# EAGLE schematic RTK_Mosaic_X5 (EAGLE 9.6.2)

## Sheet 1 of 2
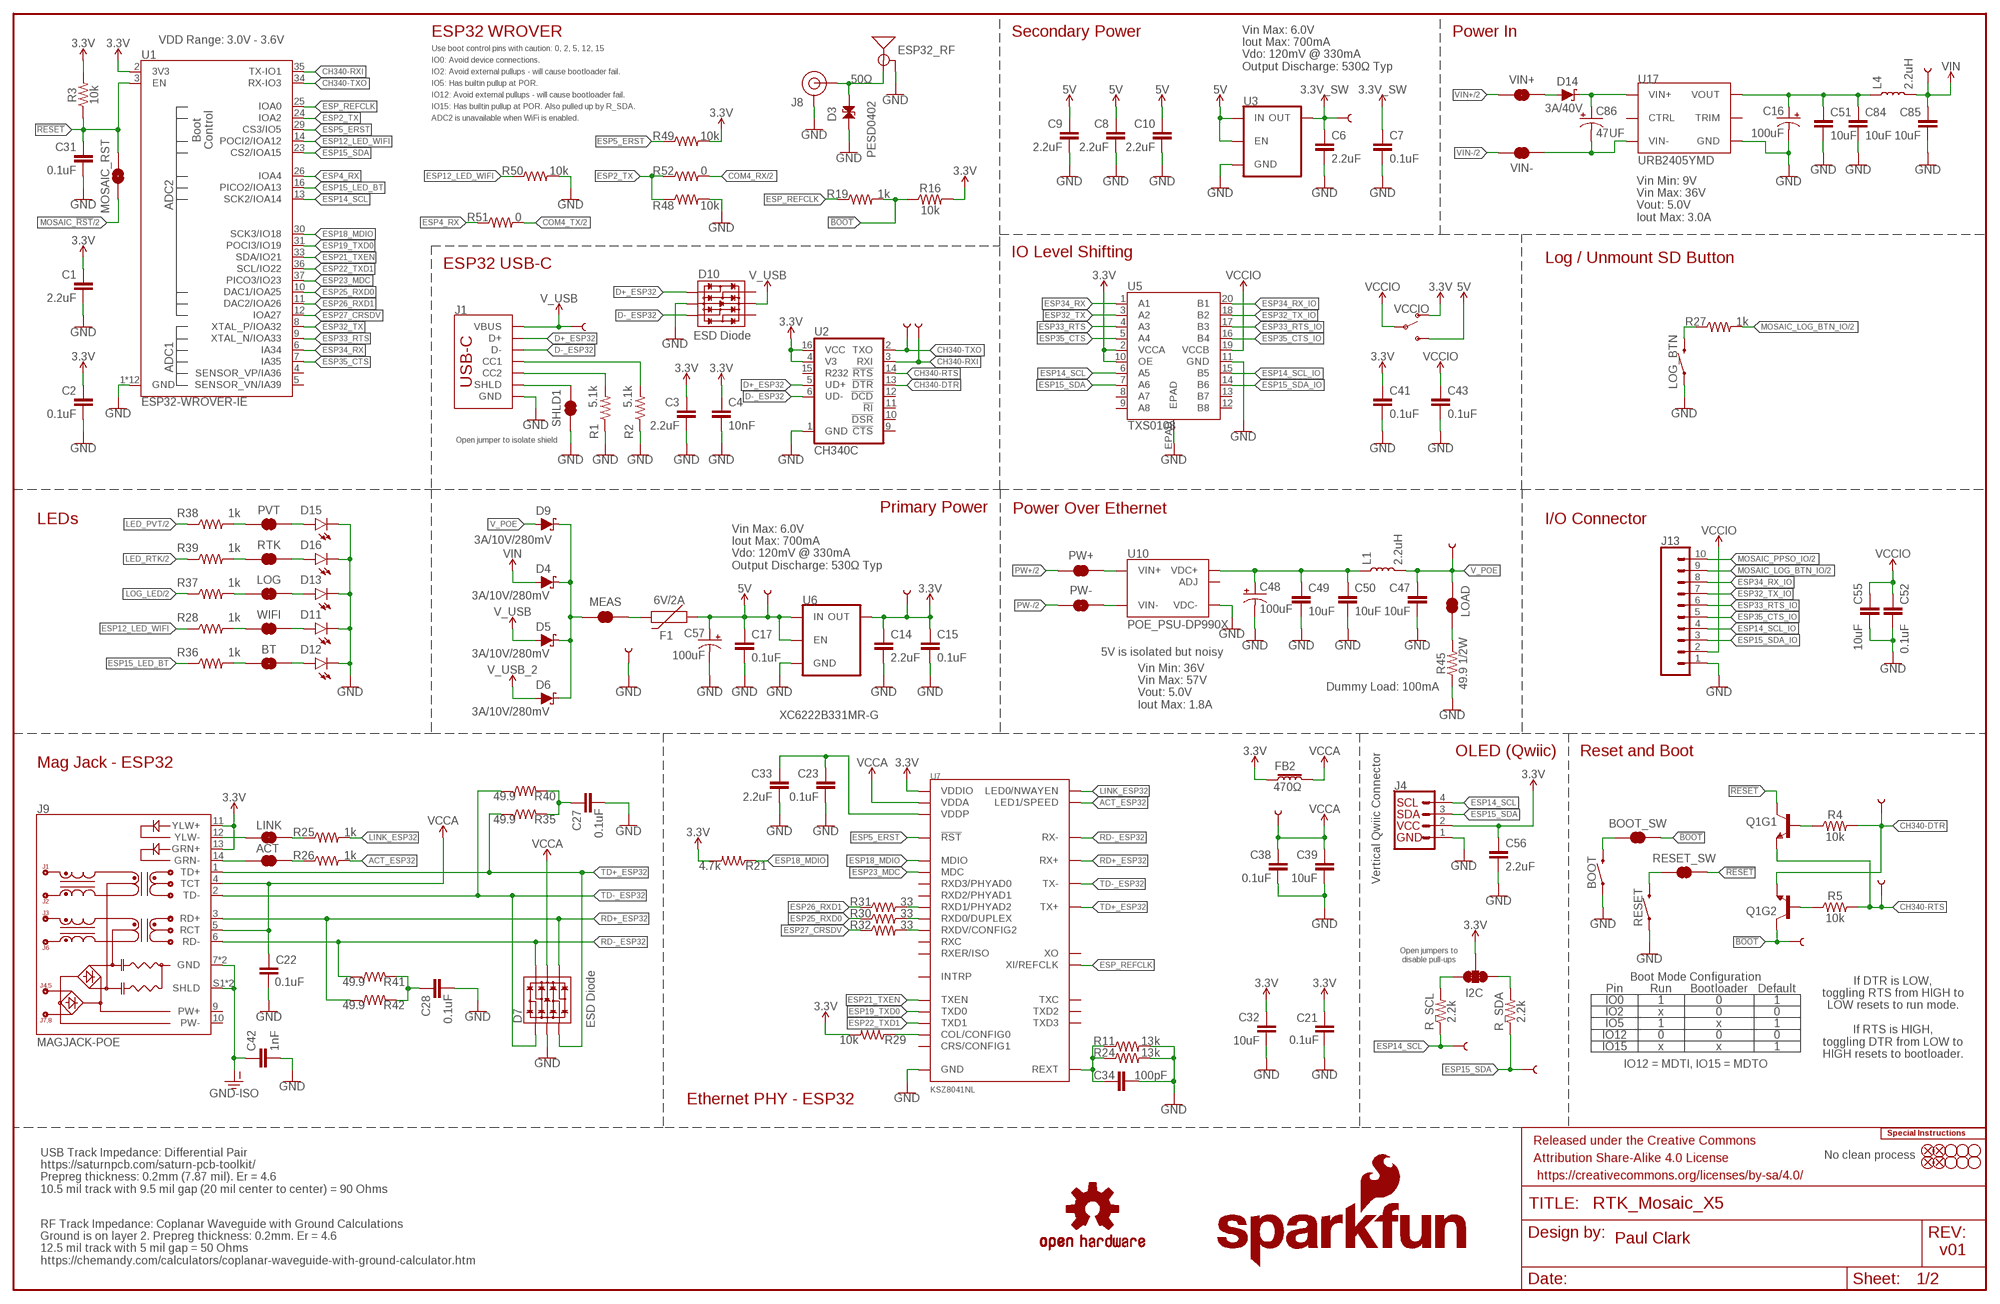
[diagram p0: schematic, sheet 1]

### Parts
3V3  TEST-POINTPOGO_PTH  [1X01_NO_SILK]
3V3_SW  TEST-POINTPOGO_PTH  [1X01_NO_SILK]
5V  TEST-POINTPOGO_PTH  [1X01_NO_SILK]
ACT  JUMPER-SMT_2_NC_TRACE_SILK  [SMT-JUMPER_2_NC_TRACE_SILK]
BOOT  MOMENTARY-SWITCH-SPST-PTH-RIGHT-ANGLE-8-020  [TACTILE_SWITCH_PTH_RA_8-020]
BOOT_SW  JUMPER-SMT_2_NC_TRACE_SILK  [SMT-JUMPER_2_NC_TRACE_SILK]
BT  JUMPER-SMT_2_NC_TRACE_SILK  [SMT-JUMPER_2_NC_TRACE_SILK]
C1  2.2uF  2.2UF-0603-10V-20%  [0603]
C2  0.1uF  0.1UF-0603-25V-5%  [0603]
C3  2.2uF  2.2UF-0603-10V-20%  [0603]
C4  10nF  10NF-0603-50V-10%  [0603]
C6  2.2uF  2.2UF-0603-10V-20%  [0603]
C7  0.1uF  0.1UF-0603-25V-5%  [0603]
C8  2.2uF  2.2UF-0603-10V-20%  [0603]
C9  2.2uF  2.2UF-0603-10V-20%  [0603]
C10  2.2uF  2.2UF-0603-10V-20%  [0603]
C14  2.2uF  2.2UF-0603-10V-20%  [0603]
C15  0.1uF  0.1UF-0603-25V-5%  [0603]
C16  100uF  100UF-POLAR-25V-20%(ELEC)  [PANASONIC_D]
C17  0.1uF  0.1UF-0603-25V-5%  [0603]
C21  0.1uF  0.1UF-0603-25V-5%  [0603]
C22  0.1uF  0.1UF-0603-25V-5%  [0603]
C23  0.1uF  0.1UF-0603-25V-5%  [0603]
C27  0.1uF  0.1UF-0603-25V-5%  [0603]
C28  0.1uF  0.1UF-0603-25V-5%  [0603]
C31  0.1uF  0.1UF-0603-25V-5%  [0603]
C32  10uF  10UF-0603-6.3V-20%  [0603]
C33  2.2uF  2.2UF-0603-10V-20%  [0603]
C34  100pF  100PF-0603-50V-5%  [0603]
C38  0.1uF  0.1UF-0603-25V-5%  [0603]
C39  10uF  10UF-0603-6.3V-20%  [0603]
C41  0.1uF  0.1UF-0603-25V-5%  [0603]
C42  1nF  1.0NF/1000PF-1206-2KV-10%  [1206]
C43  0.1uF  0.1UF-0603-25V-5%  [0603]
C47  10uF  10UF-0805-25V-10%  [0805]
C48  100uF  100UF-POLAR-25V-20%(ELEC)  [PANASONIC_D]
C49  10uF  10UF-0805-25V-10%  [0805]
C50  10uF  10UF-0805-25V-10%  [0805]
C51  10uF  10UF-0805-25V-10%  [0805]
C52  0.1uF  0.1UF-0603-25V-5%  [0603]
C55  10uF  10UF-0603-6.3V-20%  [0603]
C56  2.2uF  2.2UF-0603-10V-20%  [0603]
C57  100uF  100UF-POLAR-25V-20%(ELEC)  [PANASONIC_D]
C84  10uF  10UF-0805-25V-10%  [0805]
C85  10uF  10UF-0805-25V-10%  [0805]
C86  47UF  47UF-POLAR-PANASONIC_D-50V-20%  [PANASONIC_D]
D3  PESD0402  PESD0402-0402  [0402]
D4  3A/10V/280mV  DIODE-SCHOTTKY-BAT60A  [SOD-323]
D5  3A/10V/280mV  DIODE-SCHOTTKY-BAT60A  [SOD-323]
D6  3A/10V/280mV  DIODE-SCHOTTKY-BAT60A  [SOD-323]
D7  ESD Diode  TVS_DIODE_ARRAY_DT1042-04SO-7  [SOT-23-6]
D9  3A/10V/280mV  DIODE-SCHOTTKY-BAT60A  [SOD-323]
D10  ESD Diode  TVS_DIODE_ARRAY_DT1042-04SO-7  [SOT-23-6]
D11  LED-RIGHT-ANGLE-PTH-AMBER  [CBI-RIGHT-ANGLE-PTH]
D12  LED-RIGHT-ANGLE-PTH-BLUE  [CBI-RIGHT-ANGLE-PTH]
D13  LED-RIGHT-ANGLE-PTH-GREEN  [CBI-RIGHT-ANGLE-PTH]
D14  3A/40V  DIODE-SCHOTTKY-B340A  [SMA-DIODE]
D15  LED-RIGHT-ANGLE-PTH-BLUE  [CBI-RIGHT-ANGLE-PTH]
D16  LED-RIGHT-ANGLE-PTH-BLUE  [CBI-RIGHT-ANGLE-PTH]
DTR  TEST-POINTPOGO_PTH  [1X01_NO_SILK]
ESP32_RF  ANTENNA-SMA-GROUNDEDEDGE_RPSMA  [RP-SMA-EDGE]
F1  6V/2A  PPTC_6V2A  [1210]
FB2  470Ω  FERRITE_BEAD-0603-470Ω-100MHZ-1A-200MILIΩ  [0603]
FD1  FIDUCIAL1X2  [FIDUCIAL-1X2]
FD2  FIDUCIAL1X2  [FIDUCIAL-1X2]
FD3  FIDUCIAL1X2  [FIDUCIAL-1X2]
FD4  FIDUCIAL1X2  [FIDUCIAL-1X2]
FRAME1  FRAME-LEDGER  [CREATIVE_COMMONS]
GND  TEST-POINTPOGO_PTH  [1X01_NO_SILK]
H1  STAND-OFFTIGHT  [STAND-OFF-TIGHT]
H2  STAND-OFFTIGHT  [STAND-OFF-TIGHT]
H3  STAND-OFFTIGHT  [STAND-OFF-TIGHT]
H4  STAND-OFFTIGHT  [STAND-OFF-TIGHT]
H5  STAND-OFFTIGHT  [STAND-OFF-TIGHT]
H6  STAND-OFFTIGHT  [STAND-OFF-TIGHT]
I2C  JUMPER-SMT_3_2-NC_TRACE_SILK  [SMT-JUMPER_3_2-NC_TRACE_SILK]
J1  USB_C_4-LAYER_PADS  [USB-C-16P_4LAYER-PADS]
J4  Vertical Qwiic Connector  QWIIC_CONNECTOR  [JST04_1MM_VERT]
J8  U.FL2PIN-REDUCED-FOOTPRINT  [U.FL_REDUCED_FOOTPRINT]
J9  MAGJACK-POE  [MAGJACK-SYM_LED]
J13  CONN_10_3.5MM_RA_HEADER  [1X10_SCREW_TERMINAL_3.5MM]
L1  2.2uH  INDUCTOR-0805_WIDE-2.2UH  [0805-WIDE]
L4  2.2uH  INDUCTOR-0805_WIDE-2.2UH  [0805-WIDE]
LINK  JUMPER-SMT_2_NC_TRACE_SILK  [SMT-JUMPER_2_NC_TRACE_SILK]
LOAD  JUMPER-SMT_2_NC_TRACE_SILK  [SMT-JUMPER_2_NC_TRACE_SILK]
LOG  JUMPER-SMT_2_NC_TRACE_SILK  [SMT-JUMPER_2_NC_TRACE_SILK]
LOG_BTN  MOMENTARY-SWITCH-SPST-PTH-RIGHT-ANGLE-8-020  [TACTILE_SWITCH_PTH_RA_8-020]
LOGO1  SPECIAL_INSTRUCTIONS-ORDERING  [ORDERING_INSTRUCTIONS]
LOGO4  OSHW-LOGOS  [OSHW-LOGO-S]
LOGO5  SFE_LOGO_NAME.2_INCH  [SFE_LOGO_NAME_.2]
LOGO6  SFE_LOGO_FLAME.2_INCH  [SFE_LOGO_FLAME_.2]
MEAS  JUMPER-COMBO_2_NC_TRACE  [COMBO-JUMPER_2_NC_TRACE]
MOSAIC_RST  JUMPER-COMBO_2_NO  [COMBO-JUMPER_2_NO]
PVT  JUMPER-SMT_2_NC_TRACE_SILK  [SMT-JUMPER_2_NC_TRACE_SILK]
PW+  JUMPER-COMBO_2_NC_TRACE  [COMBO-JUMPER_2_NC_TRACE]
PW-  JUMPER-COMBO_2_NC_TRACE  [COMBO-JUMPER_2_NC_TRACE]
Q1  TRANS_NPN_DUAL-MBT3904DW1T1  [SC70-6]
R1  5.1k  5.1KOHM5.1KOHM-0603-1/10W-1%  [0603]
R2  5.1k  5.1KOHM5.1KOHM-0603-1/10W-1%  [0603]
R3  10k  10KOHM-0603-1/10W-1%  [0603]
R4  10k  10KOHM-0603-1/10W-1%  [0603]
R5  10k  10KOHM-0603-1/10W-1%  [0603]
R11  13k  13KOHM-0603-1/10W-1%  [0603]
R16  10k  10KOHM-0603-1/10W-1%  [0603]
R19  1k  1KOHM-0603-1/10W-1%  [0603]
R21  4.7k  4.7KOHM-0603-1/10W-1%  [0603]
R24  13k  13KOHM-0603-1/10W-1%  [0603]
R25  1k  1KOHM-0603-1/10W-1%  [0603]
R26  1k  1KOHM-0603-1/10W-1%  [0603]
R27  1k  1KOHM-0603-1/10W-1%  [0603]
R28  1k  1KOHM-0603-1/10W-1%  [0603]
R29  10k  10KOHM-0603-1/10W-1%  [0603]
R30  33  33OHM-0603-1/10W-1%  [0603]
R31  33  33OHM-0603-1/10W-1%  [0603]
R32  33  33OHM-0603-1/10W-1%  [0603]
R35  49.9  49.9OHM-0603-1/10W-1%  [0603]
R36  1k  1KOHM-0603-1/10W-1%  [0603]
R37  1k  1KOHM-0603-1/10W-1%  [0603]
R38  1k  1KOHM-0603-1/10W-1%  [0603]
R39  1k  1KOHM-0603-1/10W-1%  [0603]
R40  49.9  49.9OHM-0603-1/10W-1%  [0603]
R41  49.9  49.9OHM-0603-1/10W-1%  [0603]
R42  49.9  49.9OHM-0603-1/10W-1%  [0603]
R45  49.9 1/2W  49.9OHM-1206-1/2W-1%  [1206]
R48  10k  10KOHM-0603-1/10W-1%  [0603]
R49  10k  10KOHM-0603-1/10W-1%  [0603]
R50  10k  10KOHM-0603-1/10W-1%  [0603]
R51  0  0OHM-0603-1/10W  [0603]
R52  0  0OHM-0603-1/10W  [0603]
R_SCL  2.2k  2.2KOHM-0603-1/10W-1%  [0603]
R_SDA  2.2k  2.2KOHM-0603-1/10W-1%  [0603]
RESET  MOMENTARY-SWITCH-SPST-PTH-RIGHT-ANGLE-8-020  [TACTILE_SWITCH_PTH_RA_8-020]
RESET_SW  JUMPER-SMT_2_NC_TRACE_SILK  [SMT-JUMPER_2_NC_TRACE_SILK]
RTK  JUMPER-SMT_2_NC_TRACE_SILK  [SMT-JUMPER_2_NC_TRACE_SILK]
RTS  TEST-POINTPOGO_PTH  [1X01_NO_SILK]
RX  TEST-POINTPOGO_PTH  [1X01_NO_SILK]
SCL2  TEST-POINTPOGO_PTH  [1X01_NO_SILK]
SDA2  TEST-POINTPOGO_PTH  [1X01_NO_SILK]
SHLD1  JUMPER-SMT_2_NC_TRACE_SILK  [SMT-JUMPER_2_NC_TRACE_SILK]
TP_BOOT  TEST-POINTPOGO_PTH  [1X01_NO_SILK]
TX  TEST-POINTPOGO_PTH  [1X01_NO_SILK]
U1  ESP32-WROVER-IE  ESP32-WROVER-E/IE_IE-N16R8  [ESP32-WROVER-E/IE]
U2  CH340C  [SO016]
U3  XC6222B331MR-G  [SOT23-5]
U5  TXS0108  TXS0108-VFQFN_20  [VFQFN-20]
U6  XC6222B331MR-G  [SOT23-5]
U7  KSZ8041NL  [MLF55Q-32LD]
U10  POE_PSU-DP990X  [DP990X]
U17  URB2405YMD  URB_YMD-15WR3__URB2405YMD-15WR3  [URB_YMD-15WR3]
VCCA  TEST-POINTPOGO_PTH  [1X01_NO_SILK]
VCCIO  SWITCH-SPDT-SMD-AYZ0202  [SWITCH_DPDT_SMD_AYZ0202]
VIN  TEST-POINTPOGO_PTH  [1X01_NO_SILK]
VIN+  JUMPER-COMBO_2_NC_TRACE  [COMBO-JUMPER_2_NC_TRACE]
VIN-  JUMPER-COMBO_2_NC_TRACE  [COMBO-JUMPER_2_NC_TRACE]
VPOE  TEST-POINTPOGO_PTH  [1X01_NO_SILK]
VUSB  TEST-POINTPOGO_PTH  [1X01_NO_SILK]
WIFI  JUMPER-SMT_2_NC_TRACE_SILK  [SMT-JUMPER_2_NC_TRACE_SILK]

### Nets
3.3V: 3V3.1 C1.1 C2.1 C3.1 C4.1 C14.1 C15.1 C21.1 C32.1 C41.1 C56.1 FB2.1 I2C.2 J4.2 J9.11(YLW+) J9.13(GRN+) R3.2 R16.2 R21.2 R29.2 R49.2 U1.2(3V3) U2.4(V3) U2.16(VCC) U5.2(VCCA) U5.10(OE) U6.5(OUT) U7.17(VDDIO) VCCIO.1(O)
3.3V_SW: 3V3_SW.1 C6.1 C7.1 U3.5(OUT) ; also sheet 2
5V: 5V.1 C8.1 C9.1 C10.1 C17.1 C57.+ F1.1 U3.1(IN) U3.3(EN) U6.1(IN) U6.3(EN) VCCIO.3(S) ; also sheet 2
5V_RAW: C48.+ C49.1 C50.1 L1.1 U10.1(VDC+) U10.2(VDC+)
5V_RAW1: C16.+ C51.1 C84.1 L4.1 U17.4(VOUT)
!BOOT!: BOOT_SW.1 Q1.6(C) R16.1 R19.2 TP_BOOT.1
!RESET!: C31.1 MOSAIC_RST.2 MOSAIC_RST.4 Q1.3(C) R3.1 RESET_SW.1 U1.3(EN)
ACT: ACT.1 J9.14(GRN-)
ACT_ESP32: R26.2 U7.31(LED1/SPEED)
CH340-DTR: DTR.1 Q1.1(E) R4.2 U2.13(!DTR)
CH340-RTS: Q1.4(E) R5.2 RTS.1 U2.14(!RTS)
CH340-RXI: TX.1 U1.35(TX-IO1) U2.3(RXI)
CH340-TXO: RX.1 U1.34(RX-IO3) U2.2(TXO)
COM4_RX: R52.2 ; also sheet 2
COM4_TX: R51.2 ; also sheet 2
D+_ESP32: D10.1(IO1) J1.A6(D+) J1.B6(D+) U2.5(UD+)
D-_ESP32: D10.3(IO2) J1.A7(D-) J1.B7(D-) U2.6(UD-)
ESP2_TX: R48.1 R52.1 U1.24(IOA2)
ESP4_RX: R51.1 U1.26(IOA4)
ESP5_ERST: R49.1 U1.29(CS3/IO5) U7.32(!RST!)
ESP12_LED_WIFI: R28.1 R50.1 U1.14(POCI2/IOA12)
ESP14_SCL: J4.4 R_SCL.1 SCL2.1 U1.13(SCK2/IOA14) U5.6(A5)
ESP14_SCL_IO: J13.4 U5.15(B5)
ESP15_LED_BT: R36.1 U1.16(PICO2/IOA13)
ESP15_SDA: J4.3 R_SDA.1 SDA2.1 U1.23(CS2/IOA15) U5.7(A6)
ESP15_SDA_IO: J13.3 U5.14(B6)
ESP18_MDIO: R21.1 U1.30(SCK3/IO18) U7.11(MDIO)
ESP19_TXD0: U1.31(POCI3/IO19) U7.24(TXD0)
ESP21_TXEN: U1.33(SDA/IO21) U7.23(TXEN)
ESP22_TXD1: U1.36(SCL/IO22) U7.25(TXD1)
ESP23_MDC: U1.37(PICO3/IO23) U7.12(MDC)
ESP25_RXD0: R30.1 U1.10(DAC1/IOA25)
ESP26_RXD1: R31.1 U1.11(DAC2/IOA26)
ESP27_CRSDV: R32.1 U1.12(IOA27)
ESP32_TX: U1.8(XTAL_P/IOA32) U5.3(A2)
ESP32_TX_IO: J13.7 U5.18(B2)
ESP33_RTS: U1.9(XTAL_N/IOA33) U5.4(A3)
ESP33_RTS_IO: J13.6 U5.17(B3)
ESP34_RX: U1.6(IA34) U5.1(A1)
ESP34_RX_IO: J13.8 U5.20(B1)
ESP35_CTS: U1.7(IA35) U5.5(A4)
ESP35_CTS_IO: J13.5 U5.16(B4)
ESP_REFCLK: R19.1 U1.25(IOA0) U7.9(XI/REFCLK)
GND: BOOT.1 C1.2 C2.2 C3.2 C4.2 C6.2 C7.2 C8.2 C9.2 C10.2 C14.2 C15.2 C16.- C17.2 C21.2 C22.2 C23.2 C27.2 C28.2 C31.2 C32.2 C33.2 C34.2 C38.2 C39.2 C41.2 C42.2 C43.2 C47.2 C48.- C49.2 C50.2 C51.2 C52.2 C55.2 C56.2 C57.- C84.2 C85.2 D3.2 D7.2(VSS) D10.2(VSS) D11.C D12.C D13.C D15.C D16.C ESP32_RF.GND@0(GND) ESP32_RF.GND@1(GND) ESP32_RF.GND@2(GND) ESP32_RF.GND@3(GND) GND.1 J1.GND J1.GND2(GND) J4.1 J8.1(GND) J8.2(GND) J13.1 LOG_BTN.1 R1.1 R2.1 R11.2 R24.2 R45.1 R48.2 R50.2 RESET.1 SHLD1.1 U1.1(GND) U1.15(GND) U1.38(GND) U1.GND U1.GNDT1(GND) U1.GNDT2(GND) U1.GNDT3(GND) U1.GNDT4(GND) U1.GNDT5(GND) U1.GNDT6(GND) U1.GNDT7(GND) U1.GNDT8(GND) U2.1(GND) U3.2(GND) U5.11(GND) U5.EPAD U6.2(GND) U7.1(GND) U7.GND U10.3(VDC-) U17.6(GND) ; also sheet 2
GND-ISO: C42.1 J9.7(GND) J9.8(GND) J9.S1(SHLD) J9.S2(SHLD) ; also sheet 2
LED_PVT: R38.1 ; also sheet 2
LED_RTK: R39.1 ; also sheet 2
LINK: J9.12(YLW-) LINK.1
LINK_ESP32: R25.2 U7.30(LED0/NWAYEN)
LOG_LED: R37.1 ; also sheet 2
MEAS: D4.C D5.C D6.C D9.C MEAS.2 MEAS.4
MOSAIC_!RST!: MOSAIC_RST.1 MOSAIC_RST.3 ; also sheet 2
MOSAIC_LOG_BTN_IO: J13.9 R27.2 ; also sheet 2
MOSAIC_PPSO_IO: J13.10 ; also sheet 2
N$1: J1.B5(CC2) R1.2
N$2: J1.A5(CC1) R2.2
N$4: Q1.2(B) R5.1
N$5: Q1.5(B) R4.1
N$10: F1.2 MEAS.1 MEAS.3
N$11: LOG_BTN.2 R27.1
N$12: ACT.2 R26.1
N$13: D3.1 ESP32_RF.SIG(SIGNAL) J8.FEED(SIGNAL)
N$14: I2C.3 R_SCL.2
N$15: I2C.1 R_SDA.2
N$16: LOG.2 R37.2
N$17: D13.A LOG.1
N$18: D11.A WIFI.1
N$19: C27.1 R35.2 R40.2
N$20: C28.1 R41.2 R42.2
N$21: LINK.2 R25.1
N$22: BT.1 D12.A
N$23: C23.1 C33.1 U7.2(VDDP)
N$24: C34.1 R11.1 R24.1 U7.10(REXT)
N$25: R29.1 U7.28(COL/CONFIG0)
N$26: BT.2 R36.2
N$27: LOAD.1 R45.2
N$28: RESET.2 RESET_SW.2
N$29: BOOT.2 BOOT_SW.2
N$30: R30.2 U7.16(RXD0/DUPLEX)
N$31: R31.2 U7.15(RXD1/PHYAD2)
N$32: R28.2 WIFI.2
N$35: D15.A PVT.1
N$36: D16.A RTK.1
N$37: R39.2 RTK.2
N$38: PVT.2 R38.2
N$39: R32.2 U7.18(RXDV/CONFIG2)
PW1+: PW+.1 PW+.3 U10.5(VIN+) U10.6(VIN+)
PW1-: PW-.1 PW-.3 U10.7(VIN-) U10.8(VIN-)
PW+: PW+.2 PW+.4 ; also sheet 2
PW-: PW-.2 PW-.4 ; also sheet 2
RD+_ESP32: D7.4(IO3) J9.3(RD+) R42.1 U7.5(RX+)
RD-_ESP32: D7.6(IO4) J9.6(RD-) R41.1 U7.4(RX-)
SHIELD: J1.SHLD1(SHLD) J1.SHLD2(SHLD) J1.SHLD3(SHLD) J1.SHLD4(SHLD) SHLD1.2
TD+_ESP32: D7.3(IO2) J9.1(TD+) R35.1 U7.7(TX+)
TD-_ESP32: D7.1(IO1) J9.2(TD-) R40.1 U7.6(TX-)
V_POE: C47.1 D9.A L1.2 LOAD.2 VPOE.1
V_USB: D5.A D10.5(VCC) J1.VBUS1(VBUS) J1.VBUS2(VBUS) VUSB.1
V_USB_2: D6.A ; also sheet 2
VCCA: C22.1 C38.1 C39.1 D7.5(VCC) FB2.2 J9.4(TCT) J9.5(RCT) U7.3(VDDA) VCCA.1
VCCIO: C43.1 C52.1 C55.1 J13.2 U5.19(VCCB) VCCIO.2(P) ; also sheet 2
VIN: C85.1 D4.A L4.2 VIN.1
VIN1+: D14.A VIN+.1 VIN+.3
VIN1-: C86.- U17.2(VIN-) VIN-.2 VIN-.4
VIN2+: C86.+ D14.C U17.3(VIN+)
VIN+: VIN+.2 VIN+.4 ; also sheet 2
VIN-: VIN-.1 VIN-.3 ; also sheet 2
Unconnected: D10.4(IO3) D10.6(IO4) J9.9(PW+) J9.10(PW-) U1.4(SENSOR_VP/IA36) U1.5(SENSOR_VN/IA39) U2.9(!CTS) U2.10(!DSR) U2.11(!RI) U2.12(!DCD) U2.15(R232) U5.8(A7) U5.9(A8) U5.12(B8) U5.13(B7) U7.8(XO) U7.13(RXD3/PHYAD0) U7.14(RXD2/PHYAD1) U7.19(RXC) U7.20(RXER/ISO) U7.21(INTRP) U7.22(TXC) U7.26(TXD2) U7.27(TXD3) U7.29(CRS/CONFIG1) U10.4(ADJ) U17.1(CTRL) U17.5(TRIM)

### Notes on the sheet
- Secondary Power | Power In
- VDD Range: 3.0V - 3.6V | ESP32 WROVER
- Use boot control pins with caution: 0, 2, 5, 12, 15
- IO0: Avoid device connections.
- Vin Max: 6.0V
  Iout Max: 700mA
  Vdo: 120mV @ 330mA
  Output Discharge: 530Ω Typ
- IO2: Avoid external pullups - will cause bootloader fail.
- IO5: Has builtin pullup at POR. | 50Ω
- IO12: Avoid external pullups - will cause bootloader fail.
- IO15: Has builtin pullup at POR. Also pulled up by R_SDA.
- ADC2 is unavailable when WiFi is enabled.
- Vin Min: 9V
  Vin Max: 36V
  Vout: 5.0V
  Iout Max: 3.0A
- IO Level Shifting
- Log / Unmount SD Button
- ESP32 USB-C
- Open jumper to isolate shield
- Primary Power | Power Over Ethernet
- LEDs | I/O Connector
- Vin Max: 6.0V
  Iout Max: 700mA
  Vdo: 120mV @ 330mA
  Output Discharge: 530Ω Typ
- 5V is isolated but noisy
- Dummy Load: 100mA
- Vin Min: 36V
  Vin Max: 57V
  Vout: 5.0V
  Iout Max: 1.8A
- OLED (Qwiic) | Reset and Boot
- Mag Jack - ESP32
- Open jumpers to
  disable pull-ups
- Boot Mode Configuration
- If DTR is LOW,
  toggling RTS from HIGH to
  LOW resets to run mode.
  
  If RTS is HIGH,
  toggling DTR from LOW to
  HIGH resets to bootloader.
- Pin | Run | Bootloader | Default
- IO0 | 1 | 0 | 1
- IO2 | x | 0 | 0
- IO5 | 1 | x | 1
- IO12 | 0 | 0 | 0
- IO15 | x | x | 1
- IO12 = MDTI, IO15 = MDTO
- Ethernet PHY - ESP32
- USB Track Impedance: Differential Pair
  https://saturnpcb.com/saturn-pcb-toolkit/
  Prepreg thickness: 0.2mm (7.87 mil). Er = 4.6
  10.5 mil track with 9.5 mil gap (20 mil center to center) = 90 Ohms
- No clean process
- Paul Clark
- v01
- RF Track Impedance: Coplanar Waveguide with Ground Calculations
  Ground is on layer 2. Prepreg thickness: 0.2mm. Er = 4.6
  12.5 mil track with 5 mil gap = 50 Ohms
  https://chemandy.com/calculators/coplanar-waveguide-with-ground-calculator.htm

## Sheet 2 of 2
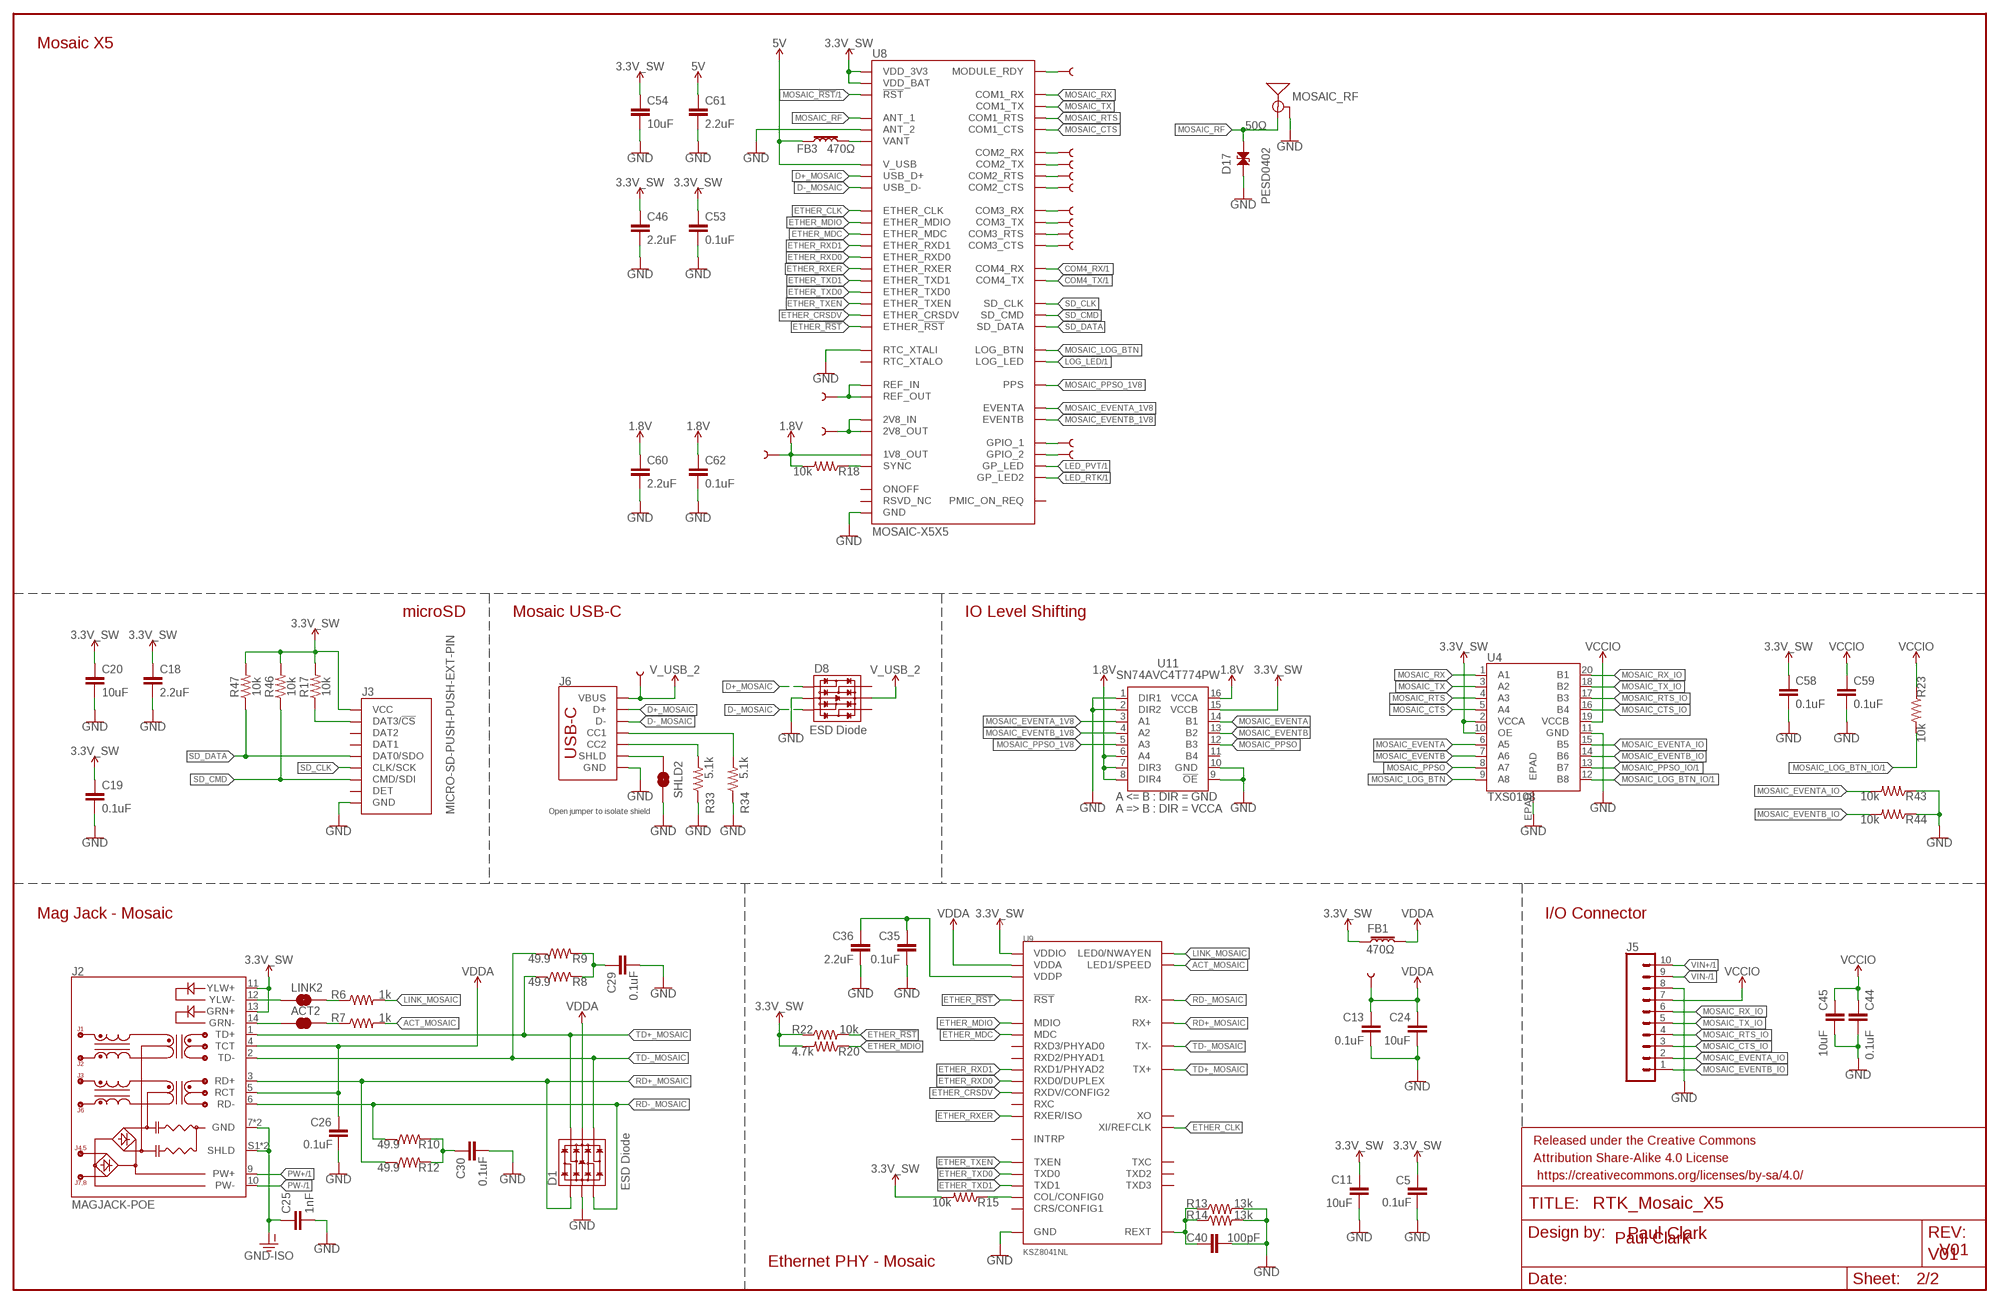
[diagram p1: schematic, sheet 2]

### Parts
1V8  TEST-POINTPOGO_PTH  [1X01_NO_SILK]
2V8  TEST-POINTPOGO_PTH  [1X01_NO_SILK]
ACT2  JUMPER-SMT_2_NC_TRACE_SILK  [SMT-JUMPER_2_NC_TRACE_SILK]
C5  0.1uF  0.1UF-0603-25V-5%  [0603]
C11  10uF  10UF-0603-6.3V-20%  [0603]
C13  0.1uF  0.1UF-0603-25V-5%  [0603]
C18  2.2uF  2.2UF-0603-10V-20%  [0603]
C19  0.1uF  0.1UF-0603-25V-5%  [0603]
C20  10uF  10UF-0603-6.3V-20%  [0603]
C24  10uF  10UF-0603-6.3V-20%  [0603]
C25  1nF  1.0NF/1000PF-1206-2KV-10%  [1206]
C26  0.1uF  0.1UF-0603-25V-5%  [0603]
C29  0.1uF  0.1UF-0603-25V-5%  [0603]
C30  0.1uF  0.1UF-0603-25V-5%  [0603]
C35  0.1uF  0.1UF-0603-25V-5%  [0603]
C36  2.2uF  2.2UF-0603-10V-20%  [0603]
C40  100pF  100PF-0603-50V-5%  [0603]
C44  0.1uF  0.1UF-0603-25V-5%  [0603]
C45  10uF  10UF-0603-6.3V-20%  [0603]
C46  2.2uF  2.2UF-0603-10V-20%  [0603]
C53  0.1uF  0.1UF-0603-25V-5%  [0603]
C54  10uF  10UF-0603-6.3V-20%  [0603]
C58  0.1uF  0.1UF-0603-25V-5%  [0603]
C59  0.1uF  0.1UF-0603-25V-5%  [0603]
C60  2.2uF  2.2UF-0603-10V-20%  [0603]
C61  2.2uF  2.2UF-0603-10V-20%  [0603]
C62  0.1uF  0.1UF-0603-25V-5%  [0603]
COM2_CTS  TEST-POINTPOGO_PTH  [1X01_NO_SILK]
COM2_RTS  TEST-POINTPOGO_PTH  [1X01_NO_SILK]
COM2_RX  TEST-POINTPOGO_PTH  [1X01_NO_SILK]
COM2_TX  TEST-POINTPOGO_PTH  [1X01_NO_SILK]
COM3_CTS  TEST-POINTPOGO_PTH  [1X01_NO_SILK]
COM3_RTS  TEST-POINTPOGO_PTH  [1X01_NO_SILK]
COM3_RX  TEST-POINTPOGO_PTH  [1X01_NO_SILK]
COM3_TX  TEST-POINTPOGO_PTH  [1X01_NO_SILK]
D1  ESD Diode  TVS_DIODE_ARRAY_DT1042-04SO-7  [SOT-23-6]
D8  ESD Diode  TVS_DIODE_ARRAY_DT1042-04SO-7  [SOT-23-6]
D17  PESD0402  PESD0402-0402  [0402]
FB1  470Ω  FERRITE_BEAD-0603-470Ω-100MHZ-1A-200MILIΩ  [0603]
FB3  470Ω  FERRITE_BEAD-0603-470Ω-100MHZ-1A-200MILIΩ  [0603]
FRAME3  FRAME-LEDGERNO_FOOTPRINT  [DUMMY]
GPIO_1  TEST-POINTPOGO_PTH  [1X01_NO_SILK]
GPIO_2  TEST-POINTPOGO_PTH  [1X01_NO_SILK]
J2  MAGJACK-POE  [MAGJACK-SYM_LED]
J3  MICRO-SD-PUSH-PUSH-EXT-PIN  [MICROSD-EXTERNALPIN]
J5  CONN_10_3.5MM_RA_HEADER  [1X10_SCREW_TERMINAL_3.5MM]
J6  USB_C_4-LAYER_PADS  [USB-C-16P_4LAYER-PADS]
LINK2  JUMPER-SMT_2_NC_TRACE_SILK  [SMT-JUMPER_2_NC_TRACE_SILK]
MOSAIC_RF  ANTENNA-SMA-GROUNDEDEDGE_SMA  [SMA-EDGE]
R6  1k  1KOHM-0603-1/10W-1%  [0603]
R7  1k  1KOHM-0603-1/10W-1%  [0603]
R8  49.9  49.9OHM-0603-1/10W-1%  [0603]
R9  49.9  49.9OHM-0603-1/10W-1%  [0603]
R10  49.9  49.9OHM-0603-1/10W-1%  [0603]
R12  49.9  49.9OHM-0603-1/10W-1%  [0603]
R13  13k  13KOHM-0603-1/10W-1%  [0603]
R14  13k  13KOHM-0603-1/10W-1%  [0603]
R15  10k  10KOHM-0603-1/10W-1%  [0603]
R17  10k  10KOHM-0603-1/10W-1%  [0603]
R18  10k  10KOHM-0603-1/10W-1%  [0603]
R20  4.7k  4.7KOHM-0603-1/10W-1%  [0603]
R22  10k  10KOHM-0603-1/10W-1%  [0603]
R23  10k  10KOHM-0603-1/10W-1%  [0603]
R33  5.1k  5.1KOHM5.1KOHM-0603-1/10W-1%  [0603]
R34  5.1k  5.1KOHM5.1KOHM-0603-1/10W-1%  [0603]
R43  10k  10KOHM-0603-1/10W-1%  [0603]
R44  10k  10KOHM-0603-1/10W-1%  [0603]
R46  10k  10KOHM-0603-1/10W-1%  [0603]
R47  10k  10KOHM-0603-1/10W-1%  [0603]
RDY  TEST-POINTPOGO_PTH  [1X01_NO_SILK]
REF  TEST-POINTPOGO_PTH  [1X01_NO_SILK]
SHLD2  JUMPER-SMT_2_NC_TRACE_SILK  [SMT-JUMPER_2_NC_TRACE_SILK]
U4  TXS0108  TXS0108-VFQFN_20  [VFQFN-20]
U8  MOSAIC-X5X5  [MOSAIC_LGA]
U9  KSZ8041NL  [MLF55Q-32LD]
U11  SN74AVC4T774PW  [SOP65P640X120-16N]
VDDA  TEST-POINTPOGO_PTH  [1X01_NO_SILK]
VUSB2  TEST-POINTPOGO_PTH  [1X01_NO_SILK]

### Nets
1.8V: 1V8.1 C60.1 C62.1 R18.2 U8.AC4(1V8_OUT) U11.6(A4) U11.7(DIR3) U11.8(DIR4) U11.16(VCCA)
2V8: 2V8.1 U8.M23(2V8_IN) U8.N23(2V8_OUT)
3.3V_SW: C5.1 C11.1 C18.1 C19.1 C20.1 C46.1 C53.1 C54.1 C58.1 FB1.1 J2.11(YLW+) J2.13(GRN+) J3.4(VCC) R15.2 R17.2 R20.2 R22.1 R46.2 R47.2 U4.2(VCCA) U4.10(OE) U8.A18(VDD_3V3) U8.A19(VDD_3V3) U8.A20(VDD_3V3) U8.B8(VDD_BAT) U8.B18(VDD_3V3) U8.B19(VDD_3V3) U8.B20(VDD_3V3) U8.C18(VDD_3V3) U8.C19(VDD_3V3) U8.C20(VDD_3V3) U9.17(VDDIO) U11.15(VCCB) ; also sheet 1
5V: C61.1 FB3.1 U8.A8(V_USB) ; also sheet 1
ACT2: ACT2.1 J2.14(GRN-)
ACT_MOSAIC: R7.2 U9.31(LED1/SPEED)
COM2_CTS: COM2_CTS.1 U8.J1(COM2_CTS)
COM2_RTS: COM2_RTS.1 U8.G1(COM2_RTS)
COM2_RX: COM2_RX.1 U8.F1(COM2_RX)
COM2_TX: COM2_TX.1 U8.H1(COM2_TX)
COM3_CTS: COM3_CTS.1 U8.N1(COM3_CTS)
COM3_RTS: COM3_RTS.1 U8.L1(COM3_RTS)
COM3_RX: COM3_RX.1 U8.K1(COM3_RX)
COM3_TX: COM3_TX.1 U8.M1(COM3_TX)
COM4_RX: U8.D3(COM4_RX) ; also sheet 1
COM4_TX: U8.E3(COM4_TX) ; also sheet 1
D+_MOSAIC: D8.1(IO1) J6.A6(D+) J6.B6(D+) U8.A5(USB_D+)
D-_MOSAIC: D8.3(IO2) J6.A7(D-) J6.B7(D-) U8.A6(USB_D-)
ETHER_!RST!: R22.2 U8.F2(ETHER_!RST!) U9.32(!RST!)
ETHER_CLK: U8.AA2(ETHER_CLK) U9.9(XI/REFCLK)
ETHER_CRSDV: U8.N2(ETHER_CRSDV) U9.18(RXDV/CONFIG2)
ETHER_MDC: U8.V2(ETHER_MDC) U9.12(MDC)
ETHER_MDIO: R20.1 U8.W2(ETHER_MDIO) U9.11(MDIO)
ETHER_RXD0: U8.R2(ETHER_RXD0) U9.16(RXD0/DUPLEX)
ETHER_RXD1: U8.T2(ETHER_RXD1) U9.15(RXD1/PHYAD2)
ETHER_RXER: U8.M2(ETHER_RXER) U9.20(RXER/ISO)
ETHER_TXD0: U8.J2(ETHER_TXD0) U9.24(TXD0)
ETHER_TXD1: U8.H2(ETHER_TXD1) U9.25(TXD1)
ETHER_TXEN: U8.L2(ETHER_TXEN) U9.23(TXEN)
GND: C5.2 C11.2 C13.2 C18.2 C19.2 C20.2 C24.2 C25.2 C26.2 C29.2 C30.2 C35.2 C36.2 C40.2 C44.2 C45.2 C46.2 C53.2 C54.2 C58.2 C59.2 C60.2 C61.2 C62.2 D1.2(VSS) D8.2(VSS) D17.2 J3.6(GND) J3.10(GND) J3.11(GND) J3.12(GND) J3.13(GND) J5.8 J6.GND J6.GND2(GND) MOSAIC_RF.GND@0(GND) MOSAIC_RF.GND@1(GND) MOSAIC_RF.GND@2(GND) MOSAIC_RF.GND@3(GND) R13.2 R14.2 R33.1 R34.1 R43.1 R44.1 SHLD2.1 U4.11(GND) U4.EPAD U8.A3(RTC_XTALI) U8.A4(GND) U8.A7(GND) U8.A15(GND) U8.A16(GND) U8.A17(GND) U8.A21(GND) U8.A22(GND) U8.A23(GND) U8.AA13(GND) U8.AA14(GND) U8.AA15(GND) U8.AA16(GND) U8.AA17(GND) U8.AA18(GND) U8.AA19(GND) U8.AA20(GND) U8.AA21(GND) U8.AA22(GND) U8.AA23(GND) U8.AB2(GND) U8.AB3(GND) U8.AB4(GND) U8.AB5(GND) U8.AB6(GND) U8.AB7(GND) U8.AB8(GND) U8.AB13(GND) U8.AB14(GND) U8.AB15(GND) U8.AB16(GND) U8.AB17(GND) U8.AB18(GND) U8.AB19(GND) U8.AB20(GND) U8.AB21(GND) U8.AB22(GND) U8.AB23(GND) U8.AC13(GND) U8.AC15(GND) U8.AC18(GND) U8.AC19(GND) U8.AC21(GND) U8.AC22(GND) U8.AC23(GND) U8.B4(GND) U8.B5(GND) U8.B6(GND) U8.B7(GND) U8.B13(GND) U8.B17(GND) U8.B21(GND) U8.C4(GND) U8.C7(GND) U8.C15(GND) U8.C16(GND) U8.C17(GND) U8.C23(GND) U8.D2(GND) U8.D21(GND) U8.D22(GND) U8.D23(GND) U8.E2(GND) U8.E21(GND) U8.E22(GND) U8.E23(GND) U8.F21(GND) U8.F22(GND) U8.F23(GND) U8.G2(GND) U8.G21(GND) U8.G23(GND) U8.H21(GND) U8.H22(GND) U8.H23(GND) U8.J21(GND) U8.J22(GND) U8.J23(GND) U8.K2(GND) U8.K21(GND) U8.K22(GND) U8.K23(GND) U8.L21(GND) U8.L22(GND) U8.L23(GND) U8.M21(GND) U8.M22(GND) U8.N21(GND) U8.N22(GND) U8.P1(GND) U8.P2(GND) U8.P3(GND) U8.P21(GND) U8.P22(GND) U8.R3(GND) U8.R21(GND) U8.R22(GND) U8.T21(GND) U8.T22(GND) U8.T23(GND) U8.U2(GND) U8.U21(GND) U8.U22(GND) U8.U23(GND) U8.V21(GND) U8.V22(GND) U8.V23(ANT_2) U8.W21(GND) U8.W22(GND) U8.W23(GND) U8.Y2(GND) U8.Y21(GND) U8.Y22(GND) U8.Y23(GND) U9.1(GND) U9.GND U11.1(DIR1) U11.2(DIR2) U11.9(!OE) U11.10(GND) ; also sheet 1
GND-ISO: C25.1 J2.7(GND) J2.8(GND) J2.S1(SHLD) J2.S2(SHLD) ; also sheet 1
GPIO_1: GPIO_1.1 U8.AA4(GPIO_1)
GPIO_2: GPIO_2.1 U8.L3(GPIO_2)
LED_PVT: U8.A14(GP_LED) ; also sheet 1
LED_RTK: U8.M3(GP_LED2) ; also sheet 1
LINK2: J2.12(YLW-) LINK2.1
LINK_MOSAIC: R6.2 U9.30(LED0/NWAYEN)
LOG_LED: U8.B2(LOG_LED) ; also sheet 1
MOSAIC_!RST!: U8.A11(!RST!) ; also sheet 1
MOSAIC_CTS: U4.5(A4) U8.E1(COM1_CTS)
MOSAIC_CTS_IO: J5.3 U4.16(B4)
MOSAIC_EVENTA: U4.6(A5) U11.14(B1)
MOSAIC_EVENTA_1V8: U8.AC6(EVENTA) U11.3(A1)
MOSAIC_EVENTA_IO: J5.2 R43.2 U4.15(B5)
MOSAIC_EVENTB: U4.7(A6) U11.13(B2)
MOSAIC_EVENTB_1V8: U8.AC7(EVENTB) U11.4(A2)
MOSAIC_EVENTB_IO: J5.1 R44.2 U4.14(B6)
MOSAIC_LOG_BTN: U4.9(A8) U8.K3(LOG_BTN)
MOSAIC_LOG_BTN_IO: R23.2 U4.12(B8) ; also sheet 1
MOSAIC_PPSO: U4.8(A7) U11.12(B3)
MOSAIC_PPSO_1V8: U8.AC8(PPS) U11.5(A3)
MOSAIC_PPSO_IO: U4.13(B7) ; also sheet 1
MOSAIC_RF: D17.1 MOSAIC_RF.SIG(SIGNAL) U8.AC20(ANT_1)
MOSAIC_RTS: U4.4(A3) U8.C1(COM1_RTS)
MOSAIC_RTS_IO: J5.4 U4.17(B3)
MOSAIC_RX: U4.1(A1) U8.B1(COM1_RX)
MOSAIC_RX_IO: J5.6 U4.20(B1)
MOSAIC_TX: U4.3(A2) U8.D1(COM1_TX)
MOSAIC_TX_IO: J5.5 U4.18(B2)
N$6: FB3.2 U8.P23(VANT) U8.R23(VANT)
N$8: J6.SHLD1(SHLD) J6.SHLD2(SHLD) J6.SHLD3(SHLD) J6.SHLD4(SHLD) SHLD2.2
N$9: R18.1 U8.AC3(SYNC)
N$33: J6.B5(CC2) R33.2
N$34: J6.A5(CC1) R34.2
N$142: ACT2.2 R7.1
N$143: LINK2.2 R6.1
N$144: C29.1 R8.2 R9.2
N$145: C30.1 R10.2 R12.2
N$146: C35.1 C36.1 U9.2(VDDP)
N$147: C40.1 R13.1 R14.1 U9.10(REXT)
N$148: R15.1 U9.28(COL/CONFIG0)
PW+: J2.9(PW+) ; also sheet 1
PW-: J2.10(PW-) ; also sheet 1
RD+_MOSAIC: D1.1(IO1) J2.3(RD+) R12.1 U9.5(RX+)
RD-_MOSAIC: D1.3(IO2) J2.6(RD-) R10.1 U9.4(RX-)
RDY: RDY.1 U8.A12(MODULE_RDY)
REF: REF.1 U8.AC16(REF_OUT) U8.AC17(REF_IN)
SD_CLK: J3.5(CLK/SCK) U8.AA1(SD_CLK)
SD_CMD: J3.3(CMD/SDI) R46.1 U8.AB1(SD_CMD)
SD_DAT3: J3.2(DAT3/!CS!) R17.1
SD_DATA: J3.7(DAT0/SDO) R47.1 U8.Y1(SD_DATA)
TD+_MOSAIC: D1.6(IO4) J2.1(TD+) R8.1 U9.7(TX+)
TD-_MOSAIC: D1.4(IO3) J2.2(TD-) R9.1 U9.6(TX-)
V_USB_2: D8.5(VCC) J6.VBUS1(VBUS) J6.VBUS2(VBUS) VUSB2.1 ; also sheet 1
VCCIO: C44.1 C45.1 C59.1 J5.7 R23.1 U4.19(VCCB) ; also sheet 1
VDDA: C13.1 C24.1 C26.1 D1.5(VCC) FB1.2 J2.4(TCT) J2.5(RCT) U9.3(VDDA) VDDA.1
VIN+: J5.10 ; also sheet 1
VIN-: J5.9 ; also sheet 1
Unconnected: D8.4(IO3) D8.6(IO4) J3.1(DAT2) J3.8(DAT1) J3.9(DET) U8.A2(RTC_XTALO) U8.A9(RSVD_NC) U8.A10(ONOFF) U8.A13(RSVD_NC) U8.AA3(RSVD_NC) U8.AA5(RSVD_NC) U8.AA6(RSVD_NC) U8.AA7(RSVD_NC) U8.AA8(RSVD_NC) U8.AA9(RSVD_NC) U8.AA10(RSVD_NC) U8.AA11(RSVD_NC) U8.AA12(RSVD_NC) U8.AB9(RSVD_NC) U8.AB10(RSVD_NC) U8.AB11(RSVD_NC) U8.AB12(RSVD_NC) U8.AC1(RSVD_NC) U8.AC2(RSVD_NC) U8.AC5(RSVD_NC) U8.AC9(RSVD_NC) U8.AC10(RSVD_NC) U8.AC11(RSVD_NC) U8.AC12(RSVD_NC) U8.AC14(RSVD_NC) U8.B3(RSVD_NC) U8.B9(RSVD_NC) U8.B10(RSVD_NC) U8.B11(RSVD_NC) U8.B12(RSVD_NC) U8.B14(RSVD_NC) U8.B15(RSVD_NC) U8.B16(PMIC_ON_REQ) U8.B22(RSVD_NC) U8.B23(RSVD_NC) U8.C2(RSVD_NC) U8.C3(RSVD_NC) U8.C5(RSVD_NC) U8.C6(RSVD_NC) U8.C8(RSVD_NC) U8.C9(RSVD_NC) U8.C10(RSVD_NC) U8.C11(RSVD_NC) U8.C12(RSVD_NC) U8.C13(RSVD_NC) U8.C14(RSVD_NC) U8.C21(RSVD_NC) U8.C22(RSVD_NC) U8.F3(RSVD_NC) U8.G3(RSVD_NC) U8.G22(RSVD_NC) U8.H3(RSVD_NC) U8.J3(RSVD_NC) U8.N3(RSVD_NC) U8.R1(RSVD_NC) U8.T1(RSVD_NC) U8.T3(RSVD_NC) U8.U1(RSVD_NC) U8.U3(RSVD_NC) U8.V1(RSVD_NC) U8.V3(RSVD_NC) U8.W1(RSVD_NC) U8.W3(RSVD_NC) U8.Y3(RSVD_NC) U9.8(XO) U9.13(RXD3/PHYAD0) U9.14(RXD2/PHYAD1) U9.19(RXC) U9.21(INTRP) U9.22(TXC) U9.26(TXD2) U9.27(TXD3) U9.29(CRS/CONFIG1) U11.11(B4)

### Notes on the sheet
- Mosaic X5
- 50Ω
- microSD | Mosaic USB-C | IO Level Shifting
- Open jumper to isolate shield
- Mag Jack - Mosaic | I/O Connector
- Ethernet PHY - Mosaic

## Library data of the parts
1V8 2V8 3V3 3V3_SW 5V COM2_CTS COM2_RTS COM2_RX COM2_TX COM3_CTS COM3_RTS COM3_RX COM3_TX DTR GND GPIO_1 GPIO_2 RDY REF RTS RX SCL2 SDA2 TP_BOOT TX VCCA VDDA VIN VPOE VUSB VUSB2 = SparkFun-Connectors:TEST-POINT: SparkFun Test Points Bare copper test points for troubleshooting or In-Circuit-Testing. These are used by our Production team for verifying production board runs using pogo-pins on test beds. SparkFun Products: SparkFun LSM9DS1 Breakout <https://www.sparkfun.com/products/13284> SparkFun PSOC <https://www.sparkfun.com/products/13714> SparkFun Load Cell Amplifier <https://www.sparkfun.com/products/13879>
ACT ACT2 BOOT_SW BT LINK LINK2 LOAD LOG PVT RESET_SW RTK SHLD1 SHLD2 WIFI = SparkFun-Jumpers:JUMPER-SMT_2_NC_TRACE: Normally closed trace jumper This jumper has a trace between two pads so it's normally closed (NC). Use a razor knife to open the connection. For best results follow the IPC guidelines for cutting traces: Cutout at least 0.063 mm (0.005 in). Remove all loose material to clean up the cut area. Seal the cut with an approved epoxy. Reapply solder to reclose the connection.
BOOT LOG_BTN RESET = SparkFun-Switches:MOMENTARY-SWITCH-SPST: Momentary Switch (Pushbutton) - SPST Normally-open (NO) SPST momentary switches (buttons, pushbuttons). Variants PTH-12MM - 12mm square, through-hole Momentary Pushbutton Switch - 12mm Square <https://www.sparkfun.com/products/9190> (COM-09190) PTH-6.0MM, PTH-6.0MM-KIT - 6.0mm square, through-hole Mini Pushbutton Switch <https://www.sparkfun.com/products/97> (COM-00097) KIT package intended for soldering kit's - only one side of pads' copper is exposed. PTH-RIGHT-ANGLE-KIT - Right-angle, through-hole Right Angle Tactile Button <https://www.sparkfun.com/products/10791> - Used on SparkFun BigTime Watch Kit <https://www.sparkfun.com/products/11734> SMD-12MM - 12mm square, surface-mount Tactile Button - SMD (12mm) <https://www.sparkfun.com/products/12993> (COM-12993) Used on SparkFun PicoBoard <https://www.sparkfun.com/products/11888> SMD-4.5MM - 4.5mm Square Trackball Switch Used on SparkFun Blackberry Trackballer Breakout <https://www.sparkfun.com/products/13169> SMD-4.6MMX2.8MM - 4.60mm x 2.80mm, surface mount Used on SparkFun Pro Micro - RP2040 <https://www.sparkfun.com/products/17717> SMD-5.2MM, SMD-5.2-REDUNDANT - 5.2mm square, surface-mount Mini Pushbutton Switch - SMD <https://www.sparkfun.com/products/8720> (COM-08720) Used on Arduino Pro Mini <https://www.sparkfun.com/products/11114> REDUNDANT package connects both switch circuits together SMD-6.0X3.5MM - 6.0 x 3.5mm, surface mount Momentary Reset Switch SMD <https://www.sparkfun.com/products/8229> (COM-08229) SMD-6.2MM-TALL - 6.2mm square, surface mount Tactile Button - SMD (6mm) <https://www.sparkfun.com/products/12992> Used on SparkFun Digital Sandbox <https://www.sparkfun.com/products/12651> SMD-RIGHT-ANGLE - Right-angle, surface mount Used on SparkFun Block for Intel® Edison - Arduino <https://www.sparkfun.com/products/13036>; PROD_ID: SWCH-13896
C1 C3 C6 C8-C10 C14 C18 C33 C36 C46 C56 C60 C61 = SparkFun-Capacitors:2.2UF: 2.2µF ceramic capacitors A capacitor is a passive two-terminal electrical component used to store electrical energy temporarily in an electric field.; PROD_ID: CAP-07888
C2 C5 C7 C13 C15 C17 C19 C21-C23 C26-C31 C35 C38 C41 C43 C44 C52 C53 C58 C59 C62 = SparkFun-Capacitors:0.1UF: 0.1µF ceramic capacitors A capacitor is a passive two-terminal electrical component used to store electrical energy temporarily in an electric field.; PROD_ID: CAP-08604
C4 = SparkFun-Capacitors:10NF: 0.01uF/10nF/10,000pF ceramic capacitors A capacitor is a passive two-terminal electrical component used to store electrical energy temporarily in an electric field. CAP-09321; PROD_ID: CAP-00867
C11 C20 C24 C32 C39 C45 C54 C55 = SparkFun-Capacitors:10UF: 10.0µF ceramic capacitors A capacitor is a passive two-terminal electrical component used to store electrical energy temporarily in an electric field.; PROD_ID: CAP-11015
C16 C48 C57 = SparkFun-Capacitors:100UF-POLAR: 100µF polarized capacitors A capacitor is a passive two-terminal electrical component used to store electrical energy temporarily in an electric field.; PROD_ID: CAP-12547
C25 C42 = SparkFun-Capacitors:1.0NF/1000PF: 1nF/1,000pF ceramic capacitors A capacitor is a passive two-terminal electrical component used to store electrical energy temporarily in an electric field.; PROD_ID: CAP-16238
C34 C40 = SparkFun-Capacitors:100PF: 100pF/0.1nF ceramic capacitors A capacitor is a passive two-terminal electrical component used to store electrical energy temporarily in an electric field.; PROD_ID: CAP-07883
C47 C49-C51 C84 C85 = SparkFun-Capacitors:10UF: 10.0µF ceramic capacitors A capacitor is a passive two-terminal electrical component used to store electrical energy temporarily in an electric field.; PROD_ID: CAP-14259
C86 = SparkFun-Capacitors:47UF-POLAR: 47µF polarized capacitors A capacitor is a passive two-terminal electrical component used to store electrical energy temporarily in an electric field.; PROD_ID: CAP-10547
D1 D7 D8 D10 = SparkFun-DiscreteSemi:TVS_DIODE_ARRAY; PROD_ID: IC-13538
D3 D17 = SparkFun-DiscreteSemi:PESD0402: ESD protection diode PESD is used to protect a signal line from ESD.; DIGIKEY_PART: PESD0402-140CT-ND; MOUSE_PART: 650-PESD0402-140; PROD_ID: DIO-15359
D4-D6 D9 = SparkFun-DiscreteSemi:DIODE-SCHOTTKY: Schottky diode A Schottky diode is a semiconductor diode which has a low forward voltage drop and a very fast switching action.; PROD_ID: DIO-14072
D11 = SparkFun-LED:LED-RIGHT-ANGLE-PTH; PROD_ID: DIO-13843
D12 D15 D16 = SparkFun-LED:LED-RIGHT-ANGLE-PTH; PROD_ID: DIO-13890
D13 = SparkFun-LED:LED-RIGHT-ANGLE-PTH; PROD_ID: DIO-13847
D14 = SparkFun-DiscreteSemi:DIODE-SCHOTTKY: Schottky diode A Schottky diode is a semiconductor diode which has a low forward voltage drop and a very fast switching action.; PROD_ID: DIO-09886; VALUE: 3A/40V/500mV
ESP32_RF = SparkFun-RF:ANTENNA-SMA-GROUNDED: SMA Antenna Connector w/ Ground Edge-mount and SMD SMA connectors for RF Antennas. **4-LAYER BOARD WARNING!!** When designing a 4-layer board using any of the SMD variants, you will need to manually add a cutout polygon on any internal power layers to make sure that you don't end up with exposed copper around the edge of the routed hole for these connectors. Exposed power copper could then short to the connector body - and that would be bad. Why hasn't anyone added the cutout polygons directly to the connector footprint? Well, your internal layers (usually 2 and 15) may be covered with GND polygons and you might well want the copper to go all the way to the edge, especially under the connector SIGNAL pin. So adding cutouts to the footprint might make matters worse, not better...; PROD_ID: CONN-00827
F1 = SparkFun-Fuses:PPTC: Resettable Fuse PPTC Resettable Fuse. Really a sort of resistor with a polymeric positive temperature coefficient whose resistance increases dramatically with an increase in temperature. When heated by the power passing through the resistance rises causing the current to be limited, protecting the circuit. This is achieved by the transition of the polymer from a crystalline to an amorphous state where the conductive carbon separates breaking the conductive pathways found in the cool crystalline structure. When a PPTC cools back down it resumes conducting letting the circuit turn back on. SparkFun Products: SparkFun RedBoard - Programmed with Arduino <https://www.sparkfun.com/products/12757> Pro Micro - 5V/16MHz <https://www.sparkfun.com/products/12640> Arduino Pro 328 - 5V/16MHz <https://www.sparkfun.com/products/10915> MP3 Trigger <https://www.sparkfun.com/products/13720>; PROD_ID: RES-14313
FB1-FB3 = SparkFun-Coils:FERRITE_BEAD: Ferrite Bead (blocks, cores, rings, chokes, etc.) Inductor with layers of ferrite used to suppress high frequencies. Often used to isolate high frequency noise. SparkFun Products: IOIO-OTG - V2.2 <https://www.sparkfun.com/products/13613> SparkFun SAMD21 Mini Breakout <https://www.sparkfun.com/products/13664> SparkFun 6 Degrees of Freedom Breakout - LSM6DS3 <https://www.sparkfun.com/products/13339> SparkFun SAMD21 Dev Breakout <https://www.sparkfun.com/products/13672> Lilypad MP3 <https://www.sparkfun.com/products/11013>; PROD_ID: NDUC-12579
FD1-FD4 = SparkFun-Aesthetics:FIDUCIAL: Fiducial Alignment Points Point-of-reference for pick-and-place machines and other optical instruments.
FRAME1 = SparkFun-Aesthetics:FRAME-LEDGER: Schematic Frame - Ledger Standard 11x14 US Ledger frame
FRAME3 = SparkFun-Aesthetics:FRAME-LEDGER: Schematic Frame - Ledger Standard 11x14 US Ledger frame; DESIGNER: Paul Clark; REV: V01
H1-H6 = SparkFun-Hardware:STAND-OFF: Stand Off Drill holes for mechanically mounting via screws, standoffs, etc. Note: Use the keepout ring to avoid running the screw head into surrounding components. Variant Overviews STAND-OFF - Mechanical footprint for a #4 phillips button head screw. STAND-OFF-TIGHT - Mechanical footprint for a #4 phillips button head screw, Example SparkFun Products Screw - Phillips Head (1/4", 4-40, 10 pack) <https://www.sparkfun.com/products/10453> (PRT-10453) Screw - Phillips Head (1/2", 4-40, 10 pack) <https://www.sparkfun.com/products/10452> (PRT-10452) Screw - Phillips Head (3/4", 4-40, 10 pack) <https://www.sparkfun.com/products/10451> (PRT-10451) Screw - Phillips Head (1", 4-40, 10 pack) <https://www.sparkfun.com/products/10450> (PRT-10450)
I2C = SparkFun-Jumpers:JUMPER-SMT_3_2-NC_TRACE: Normally closed trace jumper (2 of 2 connections) This jumper has a trace between all three pads so they are normally closed (NC). Use a razor knife to open the connection(s). For best results follow the IPC guidelines for cutting traces: Cutout at least 0.063 mm (0.005 in). Remove all loose material to clean up the cut area. Seal the cut with an approved epoxy. Reapply solder to reclose the connection(s).
J1 J6 = SparkFun-Connectors:USB_C: USB Type C 16Pin Connector Super Speed pins not available on the 16-pin purely SMD connector so this part is best for USB 2.0 implementations. D1 and D2 are tied together enabling D+/- no matter which way the cable is plugged into the connector. The two channel configuration pins (CC1/2) are exposed. These are normally connected to ground via 5.1k resistors but can be reconfigured for high current/high power applications. **4-LAYER BOARD WARNING!!** If designing 4-layer board, make sure to select the variant _4-LAYER-ISOLATED. The linked footprint (USB-C-16-4LAYER-ISOLATED) includes some very necessary cutout polygons in the inner layers (2 and 15). This prevents the PTH mounting shield legs on the USB connector from electrically connecting any other polygons on the inner layers (usually VCC and GND).; PROD_ID: CONN-14122
J2 J9 = SparkFun-Connectors:MAGJACK-POE: MAGJACK: RJ-45 with POE and LEDs This is a single port, RJ45 ethernet jacks with built in transformer (magnetics), PoE rectifier diodes, status LEDs, and shielding.; PROD_ID: CONN-16253
J3 = SparkFun-Connectors:MICRO-SD: microSD Socket for Transflash Various sockets for µSD. tDoc lines correctly indicate media card edge positions when inserting (unlocked, locked, depressed). NOTE: CD1 and CD2 are connected internally, and the default detect state of the socket is detect pin to ground. SparkFun Products: WAV Trigger <https://www.sparkfun.com/products/13660> CAN-Bus Shield <https://www.sparkfun.com/products/13262> SparkFun Level Shifing microSD Breakout <https://www.sparkfun.com/products/13743>; PROD_ID: CONN-16110
J4 = SparkFun-Connectors:QWIIC_CONNECTOR: SparkFun I2C Standard Qwiic Connector An SMD 1mm pitch JST connector makes it easy and quick (get it? Qwiic?) to connect I2C devices to each other. The Qwiic system <http://www.sparkfun.com/qwiic> enables fast and solderless connection between popular platforms and various sensors and actuators. We carry 200mm <https://www.sparkfun.com/products/14204>, 100mm <https://www.sparkfun.com/products/14205>, 50mm <https://www.sparkfun.com/products/14206>, and breadboard friendly <https://www.sparkfun.com/products/14207> Qwiic cables. We also offer 10 pcs strips <https://www.sparkfun.com/products/14323> the SMD connectors.; PROD_ID: CONN-14483
J5 J13 = SparkFun-Connectors:CONN_10: Multi connection point. Often used as Generic Header-pin footprint for 0.1 inch spaced/style header connections On any of the 0.1 inch spaced packages, you can populate with these: Break Away Headers - Straight <https://www.sparkfun.com/products/116> (PRT-00116) Break Away Male Headers - Right Angle <https://www.sparkfun.com/products/553> (PRT-00553) Female Headers <https://www.sparkfun.com/products/115> (PRT-00115) Break Away Headers - Machine Pin <https://www.sparkfun.com/products/117> (PRT-00117) Break Away Female Headers - Swiss Machine Pin <https://www.sparkfun.com/products/743> (PRT-00743) Arduino Stackable Header - 10 Pin <https://www.sparkfun.com/products/11376> (PRT-11376) For SCREWTERMINALS and SPRING TERMINALS visit here: Screw Terimnals on SparkFun.com <https://www.sparkfun.com/search/results?term=Screw+Terminals> (5mm/3.5mm/2.54mm spacing) This device is also useful as a general connection point to wire up your design to another part of your project. Our various solder wires solder well into these plated through hole pads. Hook-Up Wire - Assortment (Stranded, 22 AWG) <https://www.sparkfun.com/products/11375> (PRT-11375) Hook-Up Wire - Assortment (Solid Core, 22 AWG) <https://www.sparkfun.com/products/11367> (PRT-11367) View the entire wire category on our website here <https://www.sparkfun.com/categories/141> Special notes: Molex polarized connector foot print use with SKU : PRT-08231 with associated crimp pins and housings. 1MM SMD Version SKU: PRT-10208 NOTES ON THE VARIANTS LOCK and LOCK_LONGPADS... This footprint was designed to help hold the alignment of a through-hole component (i.e. 6-pin header) while soldering it into place. You may notice that each hole has been shifted either up or down by 0.005 of an inch from it's more standard position (which is a perfectly straight line). This slight alteration caused the pins (the squares in the middle) to touch the edges of the holes. Because they are alternating, it causes a "brace" to hold the component in place. 0.005 has proven to be the perfect amount of "off-center" position when using our standard breakaway headers. Although looks a little odd when you look at the bare footprint, once you have a header in there, the alteration is very hard to notice. Also,if you push a header all the way into place, it is covered up entirely on the bottom side.; PROD_ID: CONN-17279; STOREFRONT: PRT-21328
J8 = SparkFun-Connectors:U.FL2PIN: SMD Antenna Connector - U.FL 2mm height, 3.0mm x 3.0mm receptacle size. SparkFun Products: SparkFun WiFi Shield - ESP8266 <https://www.sparkfun.com/products/13287> SparkFun ESP8266 Thing <https://www.sparkfun.com/products/13231> SparkFun MiniGen - Pro Mini Signal Generator Shield <https://www.sparkfun.com/products/11420>; PROD_ID: CONN-09193
L1 L4 = SparkFun-Coils:INDUCTOR: Inductors Resist changes in electrical current. Basically a coil of wire. SparkFun Products: SparkFun Load Cell Amplifier - HX711 <https://www.sparkfun.com/products/13879> IOIO-OTG - V2.2 <https://www.sparkfun.com/products/13613>; PROD_ID: NDUC-14234
LOGO1 = SparkFun-Aesthetics:SPECIAL_INSTRUCTIONS: Special Ordering/Production Instructions Alert Symbol for special PCB ordering instructions or unique production process warnings. Ordering Instructions Production Instructions Types of information that should be added to box: Copper weight Soldermask color Silk color PCB thickness Number of layers PCB Standard: 1.6mm FR4 1 oz copper immersion silver plating red soldermask white silkscreen Types of information that should be added to box: Special wash requirements Depaneling instructions Humidification Glue curing Default text settings: 0.07 inch 9% ratio 50% line distance
LOGO4 = SparkFun-Aesthetics:OSHW-LOGO: Open-Source Hardware (OSHW) Logo This logo indicates the piece of hardware it is found on incorporates a OSHW license and/or adheres to the definition of open source hardware found here: http://freedomdefined.org/OSHW
LOGO5 = SparkFun-Aesthetics:SFE_LOGO_NAME: SparkFun Font Logo This is the SparkFun name logo. The logo on the schematic will always be the same size; the package variant is the height of the flame part of the logo (or the height the flame would be, if it were drawn). Default layer for the logo on the board is tSilk.
LOGO6 = SparkFun-Aesthetics:SFE_LOGO_FLAME: SparkFun Flame Logo This is the SparkFun flame logo. The logo on the schematic will always be the same size; the package variant is the height of the flame. Default layer for the logo on the board is tSilk.
MEAS PW+ PW- VIN+ VIN- = SparkFun-Jumpers:JUMPER-COMBO_2_NC_TRACE
MOSAIC_RF = SparkFun-RF:ANTENNA-SMA-GROUNDED: SMA Antenna Connector w/ Ground Edge-mount and SMD SMA connectors for RF Antennas. **4-LAYER BOARD WARNING!!** When designing a 4-layer board using any of the SMD variants, you will need to manually add a cutout polygon on any internal power layers to make sure that you don't end up with exposed copper around the edge of the routed hole for these connectors. Exposed power copper could then short to the connector body - and that would be bad. Why hasn't anyone added the cutout polygons directly to the connector footprint? Well, your internal layers (usually 2 and 15) may be covered with GND polygons and you might well want the copper to go all the way to the edge, especially under the connector SIGNAL pin. So adding cutouts to the footprint might make matters worse, not better...; PROD_ID: CONN-08289
MOSAIC_RST = SparkFun-Jumpers:JUMPER-COMBO_2_NO
Q1 = SparkFun-DiscreteSemi:TRANS_NPN_DUAL: Dual NPN Transistors in Single Package The MBT3904W1 puts two general purpose 3904 NPN transistors in a single package. Datasheet <http://www.onsemi.com/pub_link/Collateral/MBT3904DW1T1-D.PDF> SparkFun Products: SparkFun ESP32 Thing <https://www.sparkfun.com/products/13907>; PROD_ID: TRANS-13337
R1 R2 R33 R34 = SparkFun-Resistors:5.1KOHM; PROD_ID: RES-12083
R3-R5 R15-R18 R22 R23 R29 R43 R44 R46-R50 = SparkFun-Resistors:10KOHM: 10kΩ resistor A resistor is a passive two-terminal electrical component that implements electrical resistance as a circuit element. Resistors act to reduce current flow, and, at the same time, act to lower voltage levels within circuits. - Wikipedia; PROD_ID: RES-00824
R6 R7 R19 R25-R28 R36-R39 = SparkFun-Resistors:1KOHM: 1kΩ resistor A resistor is a passive two-terminal electrical component that implements electrical resistance as a circuit element. Resistors act to reduce current flow, and, at the same time, act to lower voltage levels within circuits. - Wikipedia; PROD_ID: RES-07856
R8-R10 R12 R35 R40-R42 = SparkFun-Resistors:49.9OHM: 49.9Ω resistor A resistor is a passive two-terminal electrical component that implements electrical resistance as a circuit element. Resistors act to reduce current flow, and, at the same time, act to lower voltage levels within circuits. - Wikipedia; PROD_ID: RES-16237
R11 R13 R14 R24 = SparkFun-Resistors:13KOHM: 13kΩ resistor A resistor is a passive two-terminal electrical component that implements electrical resistance as a circuit element. Resistors act to reduce current flow, and, at the same time, act to lower voltage levels within circuits. - Wikipedia; PROD_ID: RES-14017
R20 R21 = SparkFun-Resistors:4.7KOHM: 4.7kΩ resistor A resistor is a passive two-terminal electrical component that implements electrical resistance as a circuit element. Resistors act to reduce current flow, and, at the same time, act to lower voltage levels within circuits. - Wikipedia; PROD_ID: RES-07857
R30-R32 = SparkFun-Resistors:33OHM: 33Ω resistor A resistor is a passive two-terminal electrical component that implements electrical resistance as a circuit element. Resistors act to reduce current flow, and, at the same time, act to lower voltage levels within circuits. - Wikipedia; PROD_ID: RES-08270
R45 = SparkFun-Resistors:49.9OHM: 49.9Ω resistor A resistor is a passive two-terminal electrical component that implements electrical resistance as a circuit element. Resistors act to reduce current flow, and, at the same time, act to lower voltage levels within circuits. - Wikipedia; PROD_ID: RES-16252
R51 R52 = SparkFun-Resistors:0OHM: 0Ω resistor A resistor is a passive two-terminal electrical component that implements electrical resistance as a circuit element. Resistors act to reduce current flow, and, at the same time, act to lower voltage levels within circuits. - Wikipedia; PROD_ID: RES-08609
R_SCL R_SDA = SparkFun-Resistors:2.2KOHM: 2.2kΩ resistor A resistor is a passive two-terminal electrical component that implements electrical resistance as a circuit element. Resistors act to reduce current flow, and, at the same time, act to lower voltage levels within circuits. - Wikipedia; PROD_ID: RES-08272
U1 = SparkFun-RF:ESP32-WROVER-E/IE: ESP32-WROVER-E/IE ESP32-WROVER-E uses the onboard antenna. ESP32-WROVER-IE has a u.FL antenna connector, but is otherwise the same as the -E. N16R8 has 16M Flash, 8M PSRAM; PROD_ID: IC-19265
U2 = SparkFun-IC-Comms:CH340C; PROD_ID: IC-14038
U3 U6 = SparkFun-IC-Power:XC6222; IOUT: 700mA; PROD_ID: VREG-16775; VOUT: 3.3V
U4 U5 = SparkFun-IC-Comms:TXS0108: 8-Bit Bi-Directional Level Shifter For Open-Drain and Push-Pull 1.2V-3.6V (VCCA) to 1.65V-5.5V (VCCB) bi-directional level shifter with auto direction sensing. Max data rate - VCCA 1.2V: 20Mbps (50ns), VCCA 3.3V: 100Mbps (10ns) Digikey: 296-24806-2-ND (20-VFDFN) SparkFun Products Example Product (SKU); PROD_ID: IC-14343
U7 U9 = Septentrio_Mosaic:KSZ8041NL
U8 = Septentrio_Mosaic:MOSAIC-X5
U10 = SparkFun-IC-Power:POE_PSU: A special function Power Over Ethernet module with 5V or 12V output. Comes in an SMD package.; PROD_ID: IC-16251
U11 = SparkFun-IC-Comms:SN74AVC4T774PW: Texas Instruments,SN74AVC4T774PW,IC, Texas Instruments SN74AVC4T774PW, Dual, Bus Transceiver, 4-Bit Non-Inverting 3-State, 1.2 3.6 V, 16-Pin TSSOP Source: Datasheet <http://www.ti.com/lit/ds/symlink/sn74avc4t774.pdf>; PROD_ID: IC-15360
U17 = SparkFun-IC-Power:URB_YMD-15WR3: MORNSUN DC/DC Converter URB_YMD-15WR3 URB2405YMD-15WR3: Input 24V (9V-36V), Output 5.0V 3.0A; PROD_ID: COMP-19263
VCCIO = SparkFun-Switches:SWITCH-SPDT: Single Pole, Double Throw (SPDT) Switch Single-pole, double-throw (SPDT) switch. Variant Overview SMD-AYZ0202 Surface Mount DPDT Switch <https://www.sparkfun.com/products/597> (COM-00597) Used on e.g. LilyPad Arduino USB - ATmega32U4 Board <https://www.sparkfun.com/products/12049> PTH-11.6X4.0MM SPDT Mini Power Switch <https://www.sparkfun.com/products/102> (COM-00102) Used on e.g. SparkFun Simon Says - Through-Hole Soldering Kit <https://www.sparkfun.com/products/10547> (KIT-10547) PTH-11.6X4.0MM-KIT KIT version of SPDT Mini Power Switch - Simplifies soldering by removing tStop of switch pins - only one side can be soldered. PTH-11.6X4.0MM-LOCK LOCK version of SPDT Mini Power Switch - Offset pins hold switch in place for easier soldering. SMD-RIGHT-ANGLE Surface Mount Right Angle Switch <https://www.sparkfun.com/products/10860> (COM-10860) Used on e.g. SparkFun ESP8266 Thing <https://www.sparkfun.com/products/13231>; PROD_ID: SWCH-08179; SF_ID: COM-00597

## Net classes
2 3.3V: width 0.508 mm
3 RF_IN: width 0.35 mm, clearance 0.46 mm
4 USB: width 0.203 mm, clearance 0.127 mm
7 V_ZED: width 0.2 mm, clearance 0.2 mm
8 V_RF: width 0.2 mm
11 ZED_DIG: width 0.1 mm, clearance 0.1 mm